# EAGLE design Front_panel_piezo (EAGLE 9.3.1)
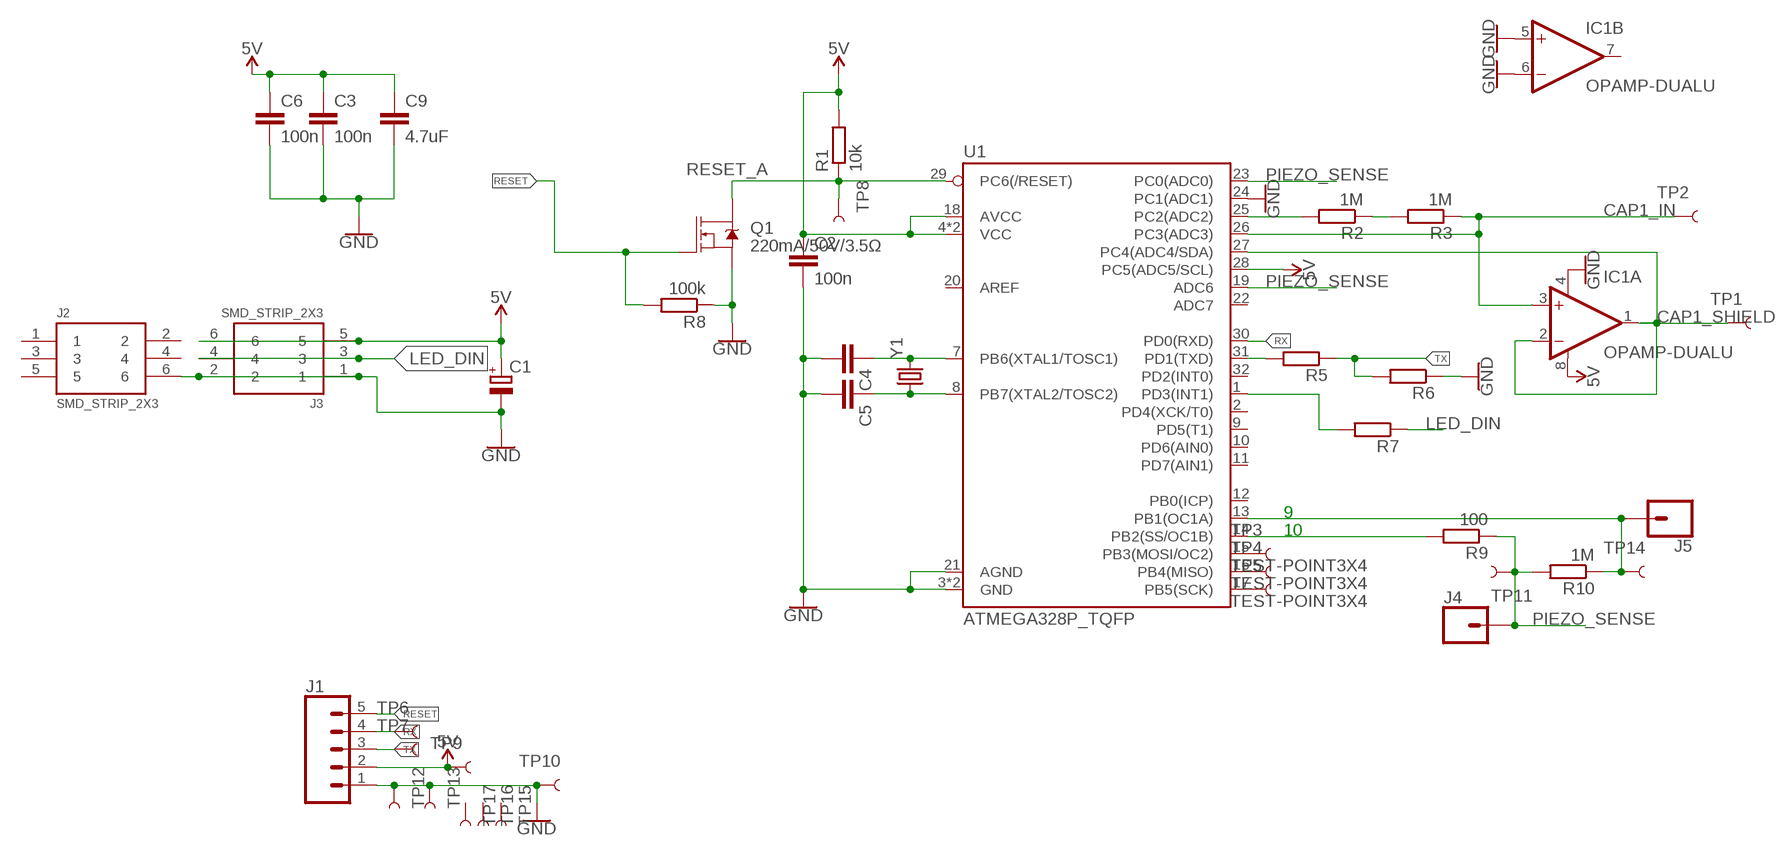
[diagram p0: schematic, sheet 1]

## Parts
C1  CPOL-EUCT6032  [CT6032]
C2  100n  C-EUC0805  [C0805]
C3  100n  C-EUC0805  [C0805]
C4  C-EUC0805  [C0805]
C5  C-EUC0805  [C0805]
C6  100n  C-EUC0805  [C0805]
C9  4.7uF  C-EUC0805  [C0805]
IC1  OPAMP-DUALU  [SO08]
J1  CONN_05SMD2  [1X05_1MM_RA]
J2  SMD_STRIP_2X3  [SMD_STRIP_2X3]
J3  SMD_STRIP_2X3  [SMD_STRIP_2X3]
J4  CONN_01SPRING-CONN  [SPRING-CONNECTOR]
J5  CONN_01SPRING-CONN  [SPRING-CONNECTOR]
Q1  220mA/50V/3.5Ω  MOSFET-NCH-BSS138  [SOT23-3]
R1  10k  R-EU_R0805  [R0805]
R2  1M  R-EU_R0805  [R0805]
R3  1M  R-EU_R0805  [R0805]
R5  R-EU_R0805  [R0805]
R6  R-EU_R0805  [R0805]
R7  R-EU_R0805  [R0805]
R8  100k  R-EU_R0805  [R0805]
R9  100  R-EU_R0805  [R0805]
R10  1M  R-EU_R0805  [R0805]
TP1  TEST-POINT3X4  [PAD.03X.04]
TP2  TEST-POINT3X4  [PAD.03X.04]
TP3  TEST-POINT3X4  [PAD.03X.04]
TP4  TEST-POINT3X4  [PAD.03X.04]
TP5  TEST-POINT3X4  [PAD.03X.04]
TP6  TEST-POINT3X4  [PAD.03X.04]
TP7  TEST-POINT3X4  [PAD.03X.04]
TP8  TEST-POINT3X4  [PAD.03X.04]
TP9  TEST-POINT3X4  [PAD.03X.04]
TP10  TEST-POINT3X4  [PAD.03X.04]
TP11  TEST-POINT3X4  [PAD.03X.04]
TP12  TEST-POINT3X4  [PAD.03X.04]
TP13  TEST-POINT3X4  [PAD.03X.04]
TP14  TEST-POINT3X4  [PAD.03X.04]
TP15  TEST-POINT3X4  [PAD.03X.04]
TP16  TEST-POINT3X4  [PAD.03X.04]
TP17  TEST-POINT3X4  [PAD.03X.04]
U1  ATMEGA328P_TQFP  [TQFP32-08]
Y1  CRYSTALSMD-3.2X2.5  [CRYSTAL-SMD-3.2X2.5MM]

## Nets
5V: C1.-(+) C2.1 C3.1 C6.1 C9.1 IC1.8(A:V+) J1.2 J3.5 J3.6 R1.2 TP9.P$1 U1.4(VCC) U1.6(VCC) U1.18(AVCC) U1.28(PC5(ADC5/SCL))
CAP1_IN: IC1.3(A:+IN) R3.1 TP2.P$1 U1.26(PC3(ADC3))
CAP1_SHIELD: IC1.1(A:OUT) IC1.2(A:-IN) TP1.P$1 U1.27(PC4(ADC4/SDA))
GND: C1.+(-) C2.2 C3.2 C4.2 C5.2 C6.2 C9.2 IC1.4(A:V-) IC1.5(B:+IN) IC1.6(B:-IN) J1.1 J2.6 J3.1 J3.2 Q1.2(S) R6.1 R8.1 TP10.P$1 TP12.P$1 TP13.P$1 U1.3(GND) U1.5(GND) U1.21(AGND) U1.24(PC1(ADC1))
LED_DIN: J3.3 J3.4 R7.1
N$1: R2.2 U1.25(PC2(ADC2))
N$2: R7.2 U1.1(PD3(INT1))
N$3: R2.1 R3.2
N$4: C4.1 U1.7(PB6(XTAL1/TOSC1)) Y1.3
N$5: C5.1 U1.8(PB7(XTAL2/TOSC2)) Y1.1
N$9: R5.2 U1.31(PD1(TXD))
N$10: J5.P$2 R10.1 TP14.P$1 U1.13(PB1(OC1A))
N$11: R9.2 U1.14(PB2(SS/OC1B))
N$14: TP3.P$1 U1.15(PB3(MOSI/OC2))
N$15: TP4.P$1 U1.16(PB4(MISO))
N$16: TP5.P$1 U1.17(PB5(SCK))
PIEZO_SENSE: J4.P$2 R9.1 R10.2 TP11.P$1 U1.19(ADC6) U1.23(PC0(ADC0))
RESET: J1.5 Q1.1(G) R8.2
RESET_A: Q1.3(D) R1.1 TP8.P$1 U1.29(PC6(/RESET))
RX: J1.4 TP6.P$1 U1.30(PD0(RXD))
TX: J1.3 R5.1 R6.2 TP7.P$1
Unconnected: IC1.7(B:OUT) J2.1 J2.2 J2.3 J2.4 J2.5 TP15.P$1 TP16.P$1 TP17.P$1 U1.2(PD4(XCK/T0)) U1.9(PD5(T1)) U1.10(PD6(AIN0)) U1.11(PD7(AIN1)) U1.12(PB0(ICP)) U1.20(AREF) U1.22(ADC7) U1.32(PD2(INT0))

## Notes on the sheet
- 9
- 10

## Library data of the parts
C1 = resistor:CPOL-EU: POLARIZED CAPACITOR, European symbol
C2-C6 C9 = resistor:C-EU: CAPACITOR, European symbol
IC1 = SparkFun:OPAMP-DUAL: Operational Amplifier
J1 = mastrogippo:CONN_05: Multi connection point. Often used as Generic Header-pin footprint for 0.1 inch spaced/style header connections On any of the 0.1 inch spaced packages, you can populate with these: Break Away Headers - Straight <https://www.sparkfun.com/products/116> (PRT-00116) Break Away Male Headers - Right Angle <https://www.sparkfun.com/products/553> (PRT-00553) Female Headers <https://www.sparkfun.com/products/115> (PRT-00115) Break Away Headers - Machine Pin <https://www.sparkfun.com/products/117> (PRT-00117) Break Away Female Headers - Swiss Machine Pin <https://www.sparkfun.com/products/743> (PRT-00743) For SCREWTERMINALS and SPRING TERMINALS visit here: Screw Terimnals on SparkFun.com <https://www.sparkfun.com/search/results?term=Screw+Terminals> (5mm/3.5mm/2.54mm spacing) This device is also useful as a general connection point to wire up your design to another part of your project. Our various solder wires solder well into these plated through hole pads. Hook-Up Wire - Assortment (Stranded, 22 AWG) <https://www.sparkfun.com/products/11375> (PRT-11375) Hook-Up Wire - Assortment (Solid Core, 22 AWG) <https://www.sparkfun.com/products/11367> (PRT-11367) View the entire wire category on our website here <https://www.sparkfun.com/categories/141> Special notes: Molex polarized connector foot print use with SKU : PRT-08231 with associated crimp pins and housings. 1MM SMD Version SKU: PRT-10208
J2 J3 = mastrogippo:SMD_STRIP_2X3: DOUBLE HORIZONTAL TERMINAL STRIP.
J4 J5 = SparkFun-Connectors:CONN_01: Single connection point. Often used as Generic Header-pin footprint for 0.1 inch spaced/style header connections On any of the 0.1 inch spaced packages, you can populate with these: Break Away Headers - Straight <https://www.sparkfun.com/products/116> (PRT-00116) Break Away Male Headers - Right Angle <https://www.sparkfun.com/products/553> (PRT-00553) Female Headers <https://www.sparkfun.com/products/115> (PRT-00115) Break Away Headers - Machine Pin <https://www.sparkfun.com/products/117> (PRT-00117) Break Away Female Headers - Swiss Machine Pin <https://www.sparkfun.com/products/743> (PRT-00743) This device is also useful as a general connection point to wire up your design to another part of your project. Our various solder wires solder well into these plated through hole pads. Hook-Up Wire - Assortment (Stranded, 22 AWG) <https://www.sparkfun.com/products/11375> (PRT-11375) Hook-Up Wire - Assortment (Solid Core, 22 AWG) <https://www.sparkfun.com/products/11367> (PRT-11367) View the entire wire category on our website here <https://www.sparkfun.com/categories/141> Special notes: SMTSO-256-ET is a "flush mount" nut for a 4-40 screw. We mostly use this on specialty testbeds; it is a nice way to connect hardware to your PCB at an adjustable hieght. Also note, the SNAP packages are for using a snappable style connector. We sell a baggie of snaps and they are also used on two LilyPad designs: Snap Assortment - 30 pack (male and female) <https://www.sparkfun.com/products/11347> (DEV-11347) LilyPad Arduino SimpleSnap <https://www.sparkfun.com/products/10941> (DEV-10941) LilyPad SimpleSnap Protoboard <https://www.sparkfun.com/products/10940> (DEV-10940); SF_ID: PRT-11822
Q1 = SparkFun-DiscreteSemi:MOSFET-NCH: N-channel MOSFETs Voltage controlled devices that allow control of high current outputs. SparkFun Products: SparkFun OpenScale <https://www.sparkfun.com/products/13261> SparkFun Digital Sandbox <https://www.sparkfun.com/products/12651> SparkFun Monster Moto Shield <https://www.sparkfun.com/products/10182> SparkFun MOSFET Power Controller <https://www.sparkfun.com/products/11214>; PROD_ID: TRANS-00830
R1-R3 R5-R10 = resistor:R-EU_: RESISTOR, European symbol
TP1-TP17 = SparkFun-Connectors:TEST-POINT: SparkFun Test Points Bare copper test points for troubleshooting or In-Circuit-Testing. These are used by our Production team for verifying production board runs using pogo-pins on test beds. SparkFun Products: SparkFun LSM9DS1 Breakout <https://www.sparkfun.com/products/13284> SparkFun PSOC <https://www.sparkfun.com/products/13714> SparkFun Load Cell Amplifier <https://www.sparkfun.com/products/13879>
U1 = SparkFun-IC-Microcontroller:ATMEGA328P_TQFP: Popular 328P in QFP Storefront component: ATmega328 - TQFP <https://www.sparkfun.com/products/13448> (COM-13448) Datasheet <http://www.sparkfun.com/datasheets/Components/SMD/ATMega328.pdf> SparkFun Products SparkFun RedBoard - Programmed with Arduino <https://www.sparkfun.com/products/12757> (DEV-12757) Arduino Pro Mini 328 - 5V/16MHz <https://www.sparkfun.com/products/11113> (DEV-11113) Arduino Pro Mini 328 - 3.3V/8MHz <https://www.sparkfun.com/products/11114> (DEV-11114) SparkFun OpenLog <https://www.sparkfun.com/products/13712> (DEV-13712) SparkFun MicroView - OLED Arduino Module <https://www.sparkfun.com/products/12923> (DEV-12923) SparkFun Digital Sandbox <https://www.sparkfun.com/products/12651> (DEV-12651) SparkFun PicoBoard <https://www.sparkfun.com/products/11888> (WIG-11888) Arduino Fio <https://www.sparkfun.com/products/10116> (DEV-10116) LilyPad Arduino 328 Main Board <https://www.sparkfun.com/products/13342> (DEV-13342) SparkFun RedStick <https://www.sparkfun.com/products/13741> (DEV-13741) LilyPad MP3 <https://www.sparkfun.com/products/11013> (DEV-11013) LilyPad Arduino SimpleSnap <https://www.sparkfun.com/products/10941> (DEV-10941) SparkFun Stepoko <https://www.sparkfun.com/products/13899> (ROB-13899) SparkFun Geiger Counter <https://www.sparkfun.com/products/11345> (SEN-11345) SparkFun EL Sequencer <https://www.sparkfun.com/products/12781> (COM-12781) Arduino Pro 328 - 5V/16MHz <https://www.sparkfun.com/products/10915> (DEV-10915) CryptoCape <https://www.sparkfun.com/products/12773> (DEV-12773) SparkFun IR Thermometer Evaluation Board - MLX90614 <https://www.sparkfun.com/products/10740> (SEN-10740) SparkFun RedBot Mainboard <https://www.sparkfun.com/products/12097> (ROB-12097) Arduino Pro 328 - 3.3V/8MHz <https://www.sparkfun.com/products/10914> (DEV-10914) SparkFun Block for Intel® Edison - Arduino <https://www.sparkfun.com/products/13036> (DEV-13036) SparkFun Simon Says - Surface Mount Soldering Kit <https://www.sparkfun.com/products/10935> (KIT-10935) SparkFun 7-Segment Serial Display - Red <https://www.sparkfun.com/products/11441> (COM-11441) SparkFun 7-Segment Serial Display - White <https://www.sparkfun.com/products/11629> (COM-11629) SparkFun 7-Segment Serial Display - Yellow <https://www.sparkfun.com/products/11443> (COM-11443) SparkFun 7-Segment Serial Display - Kelly Green <https://www.sparkfun.com/products/11440> (COM-11440) SparkFun 7-Segment Serial Display - Blue <https://www.sparkfun.com/products/11442> (COM-11442) SparkFun OpenSegment Serial Display - 20mm (Blue) <https://www.sparkfun.com/products/11647> (COM-11647) SparkFun OpenSegment Serial Display - 20mm (Green) <https://www.sparkfun.com/products/11646> (COM-11646) SparkFun OpenSegment Serial Display - 20mm (White) <https://www.sparkfun.com/products/11648> (COM-11648) SparkFun OpenSegment Serial Display - 20mm (Red) <https://www.sparkfun.com/products/11644> (COM-11644) SparkFun OpenSegment Serial Display - 20mm (Yellow) <https://www.sparkfun.com/products/11645> (COM-11645) SparkFun OpenSegment Shield <https://www.sparkfun.com/products/13190> (DEV-13190); PROD_ID: IC-09069
Y1 = SparkFun-Clocks:CRYSTAL: Crystals (Generic) These are passive quartz crystals, which can be used as a clock source for a microcontroller. Crystal's are two-terminal devices. They require external "load" capacitors to generate an oscillating signal.

## Board
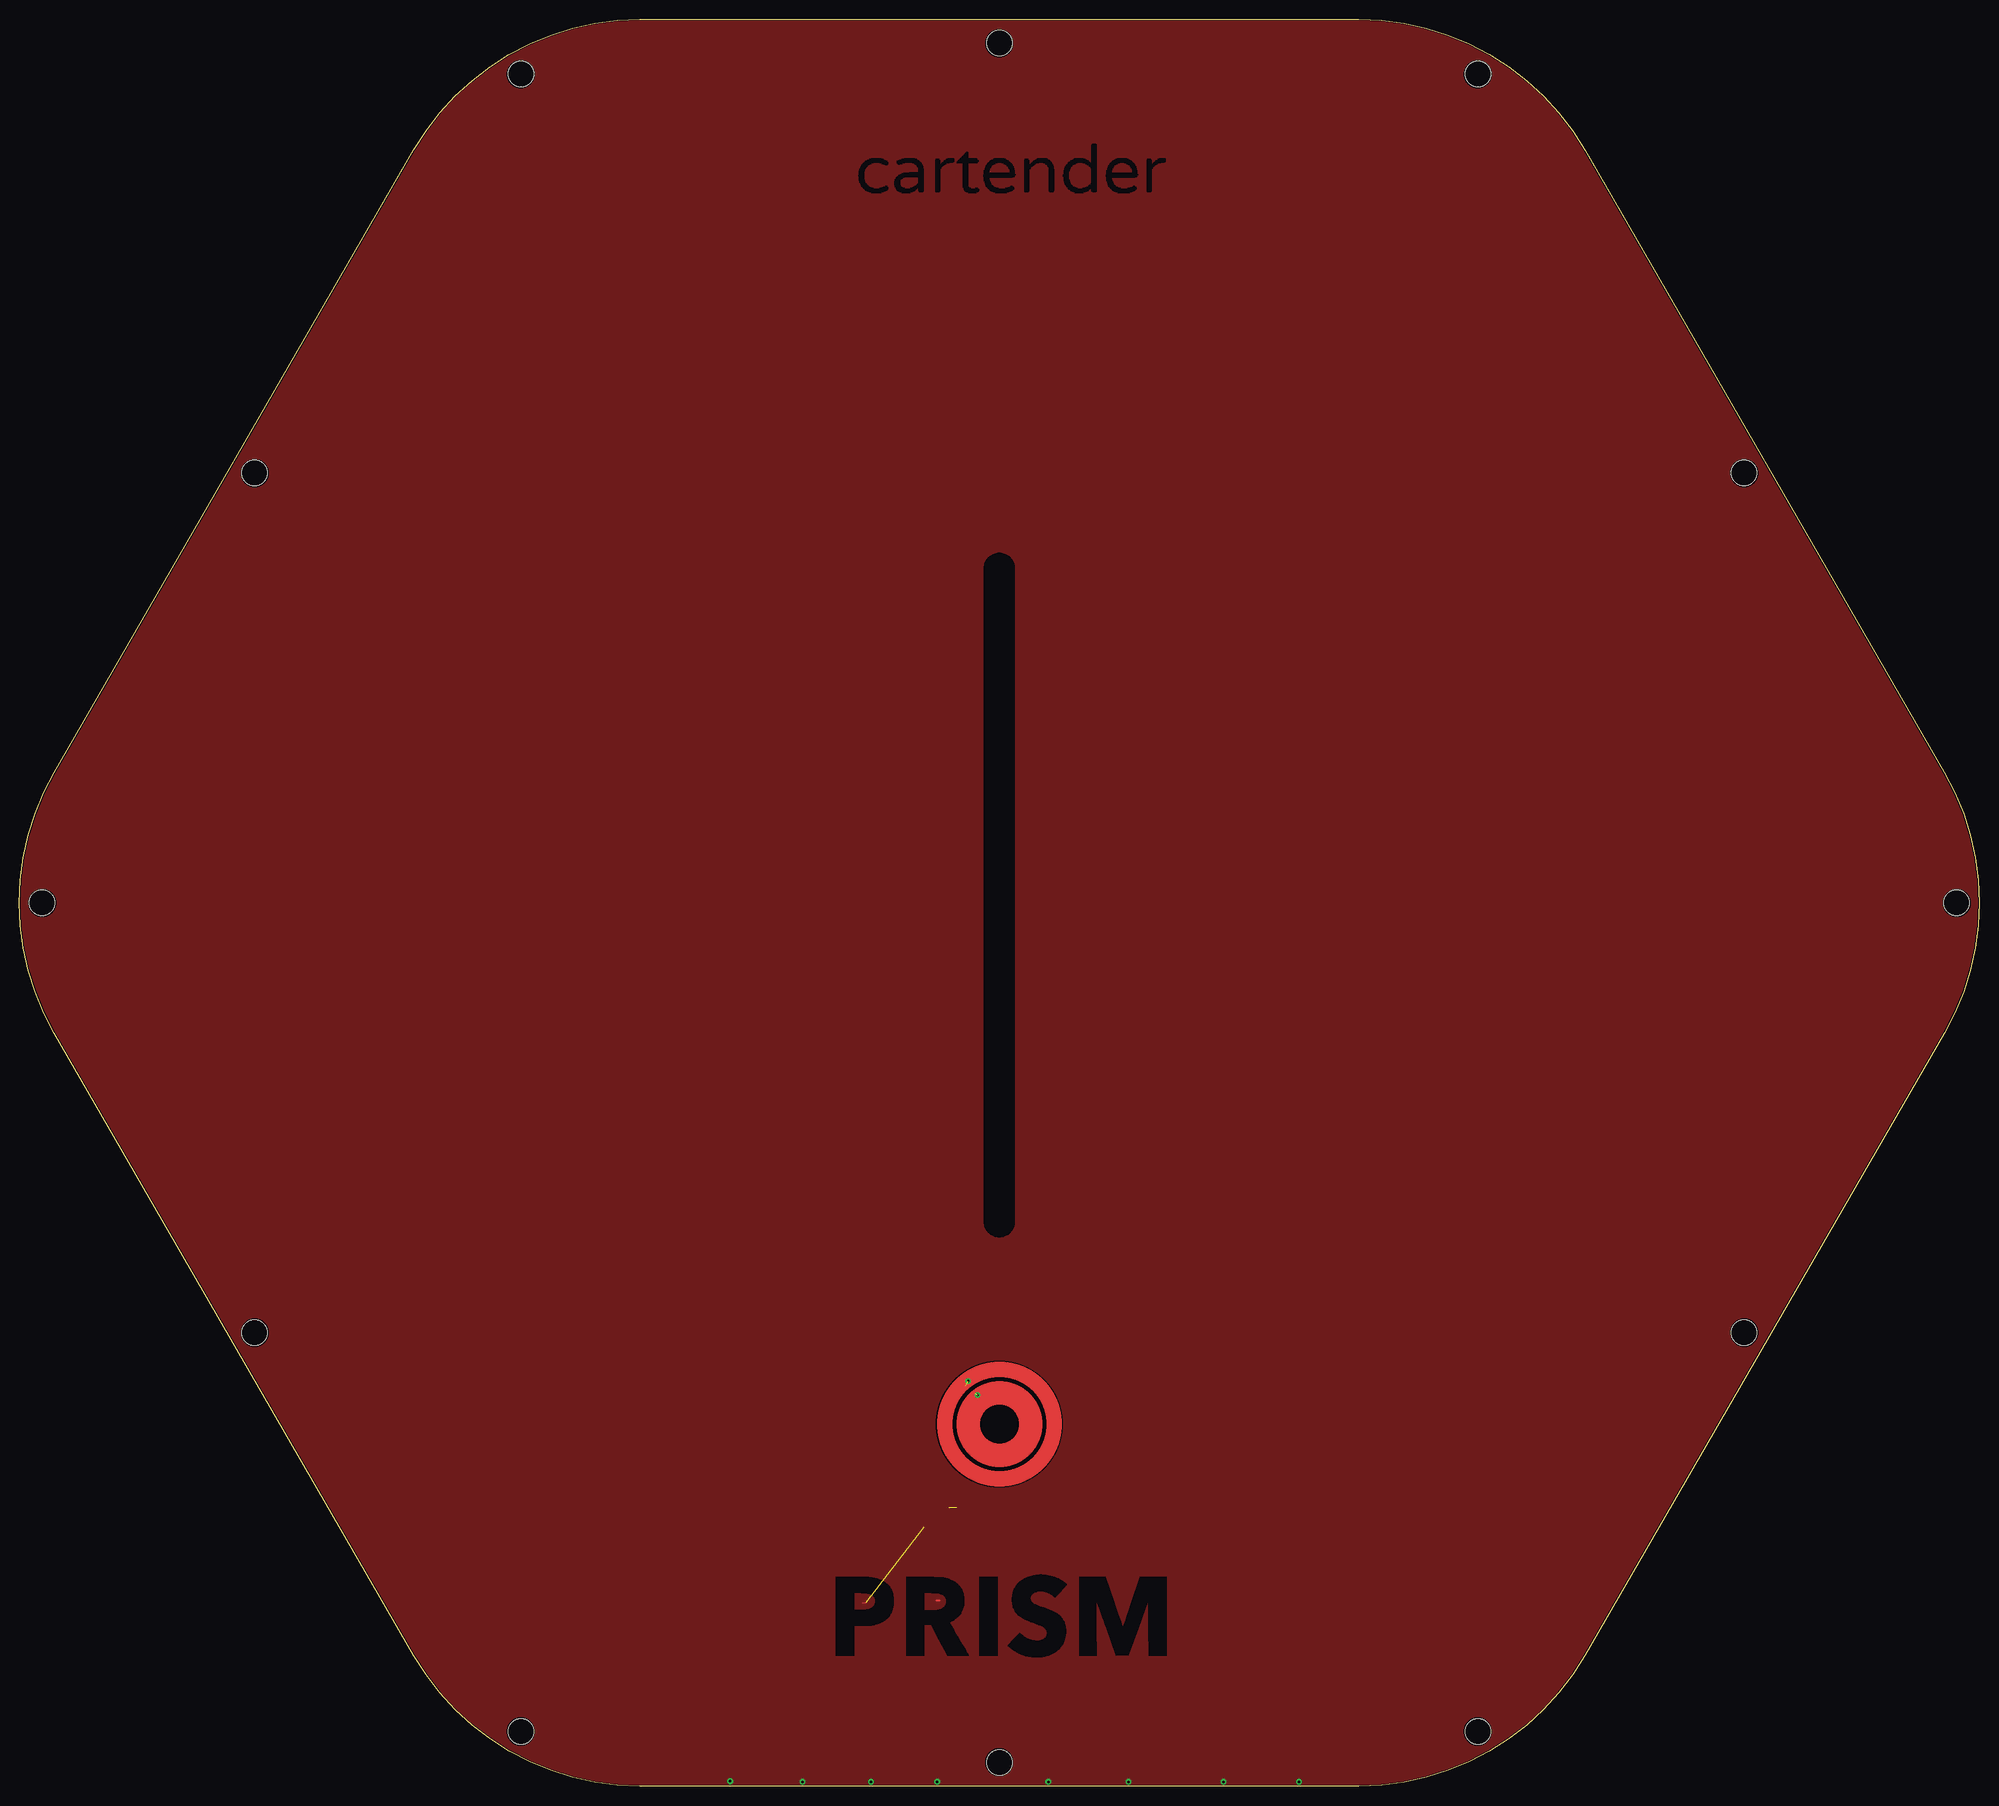
[diagram p1: board, top side]
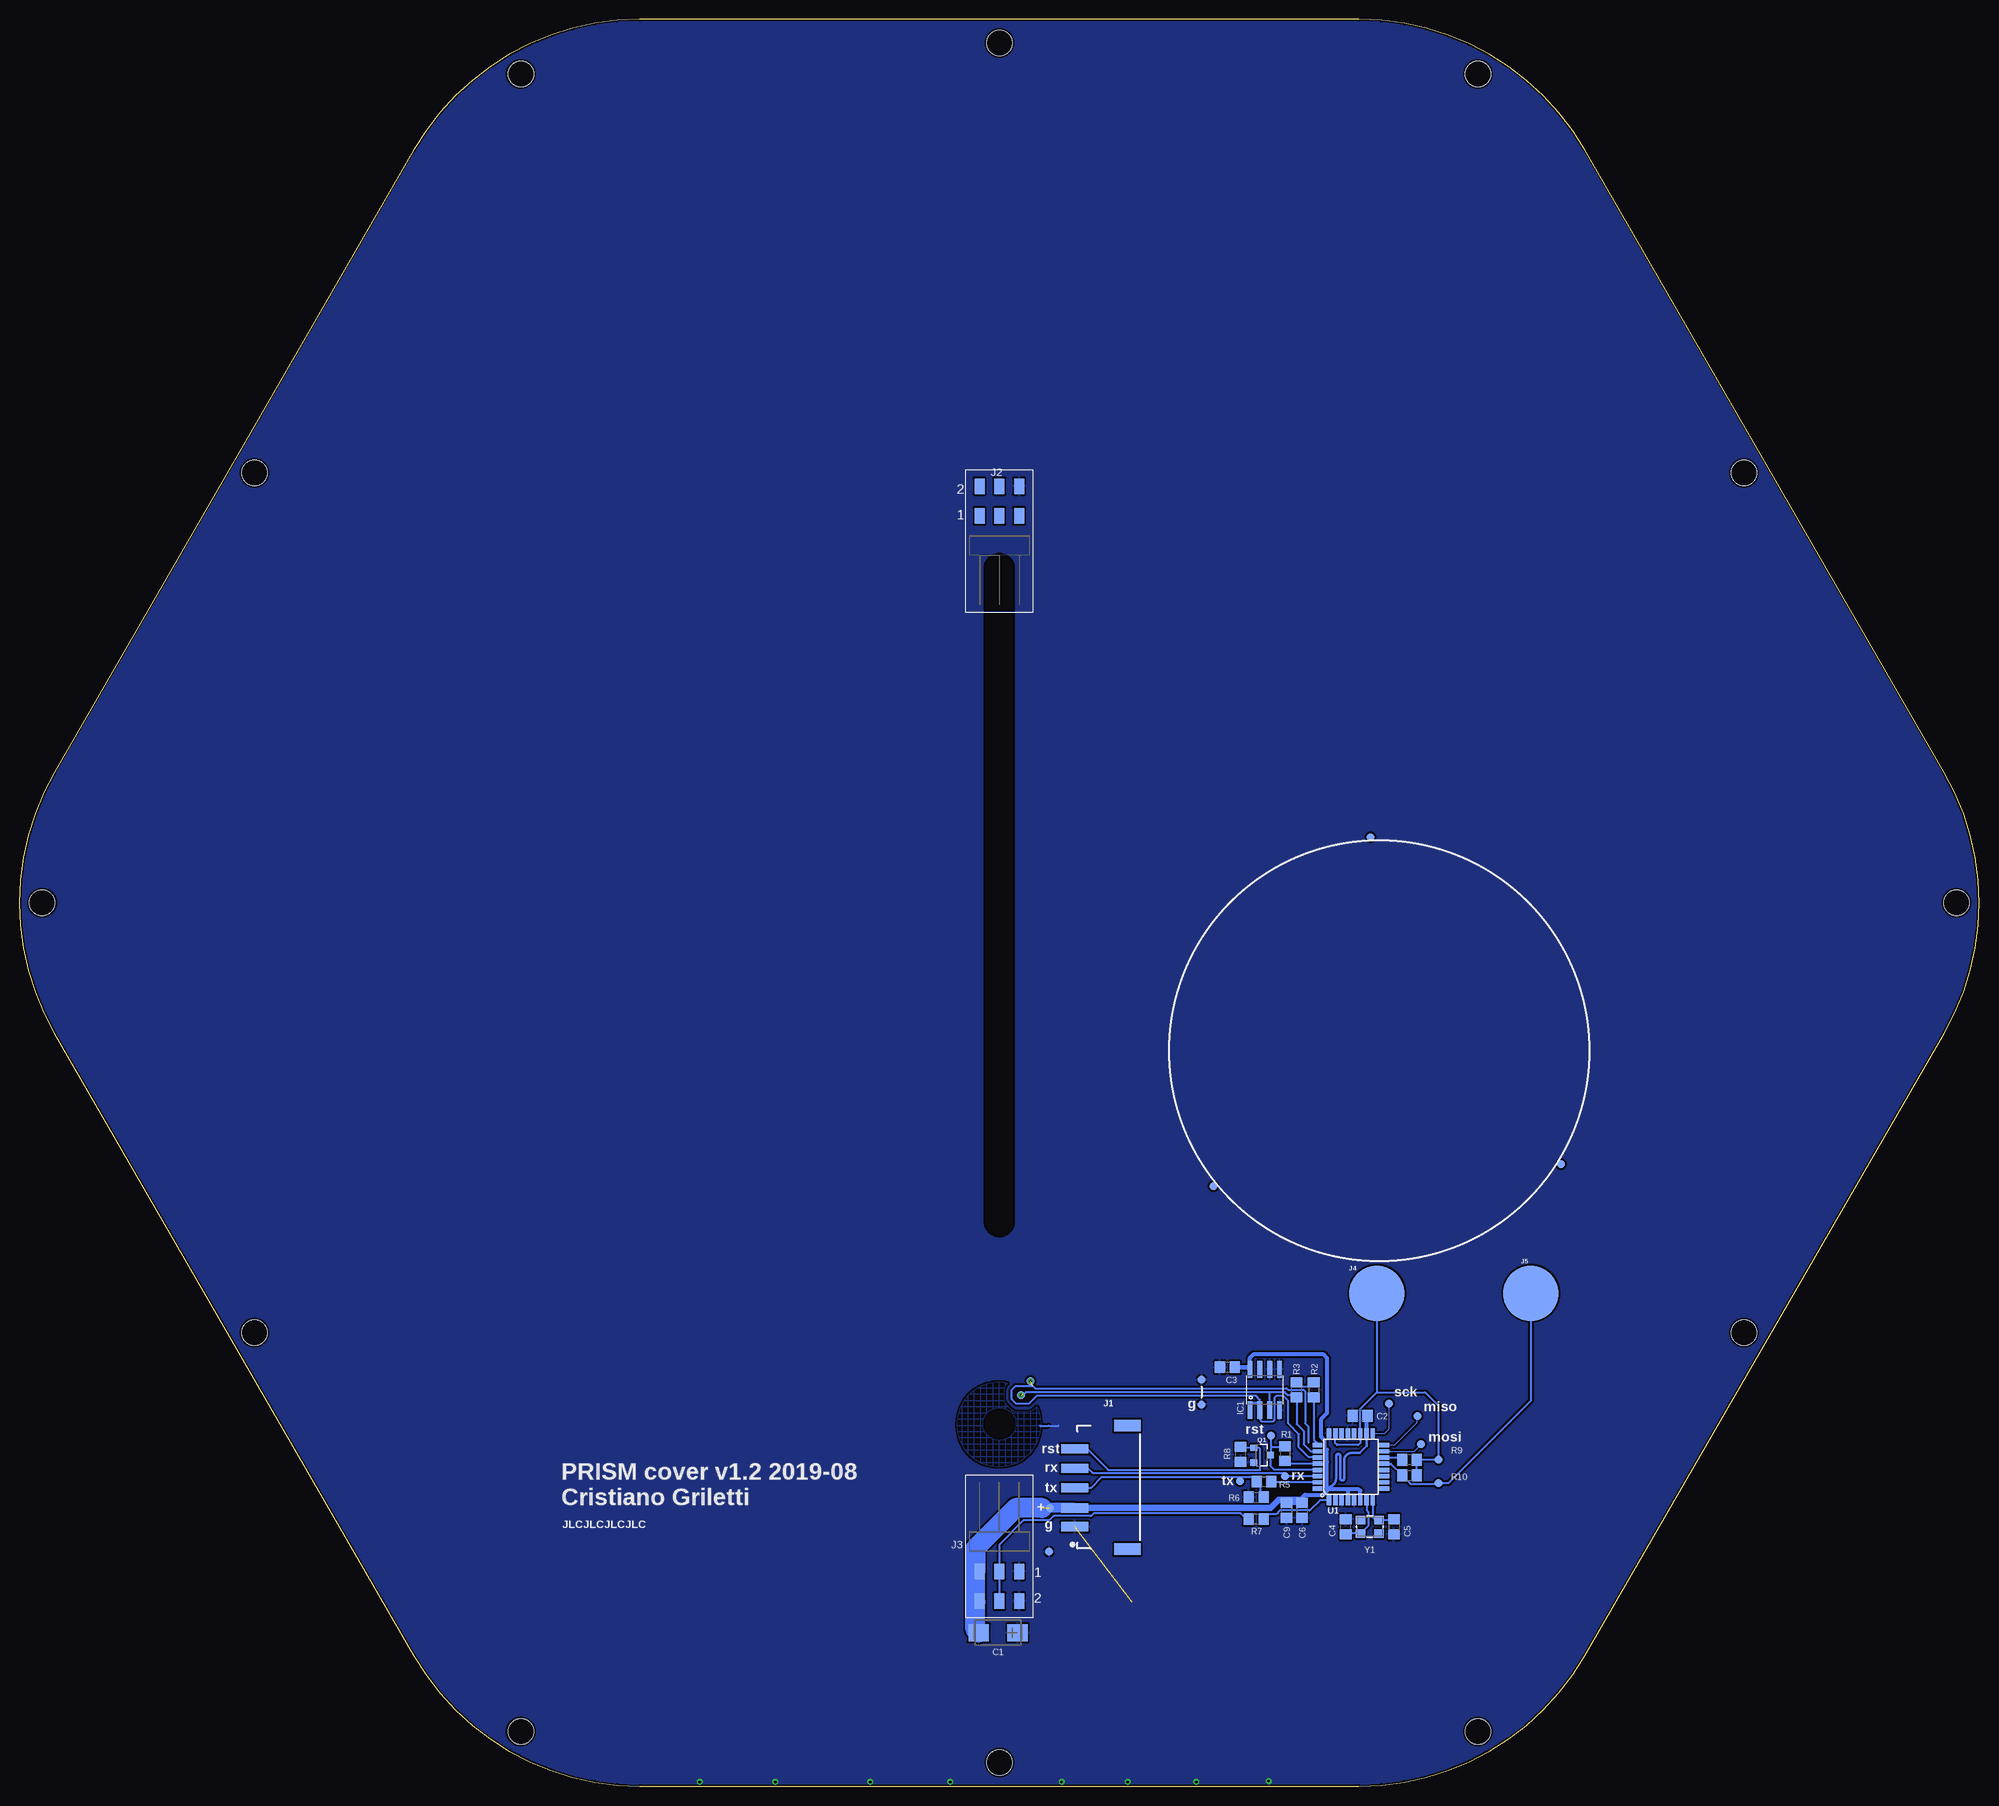
[diagram p2: board, bottom side, seen from below]

Size 251.85 x 227.1 mm. Coordinates in mm from the lower left corner, seen from the top.
Outline: 50.68,210.32 arc-60 79.74,227.1 172.11,227.1 arc-60 201.17,210.32 247.35,130.32 arc-60 247.35,96.77 201.17,16.77 arc-60 172.11,0 79.74,0 arc-60 50.68,16.77 4.5,96.77 arc-60 4.5,130.32 50.68,210.32
Copper layers (1*16): Top 0.035mm / dielectric 1.5mm / Bottom 0.035mm
Design rules "default *": minimum track width 6mil, minimum drill 0.3mm, track to track 6mil, track to pad 6mil, pad to pad 6mil, via to via 6mil, smd to smd 6mil, copper to edge 6mil, drill to drill 6mil, minimum pad ring 10mil, minimum via ring 8mil, stop-mask expansion 4mil, vias tented up to drill 100mil, thermal gap 10mil
Holes 3.3 mm at 64.42,7.03 125.92,3.05 30.22,58.3 2.92,113.55 248.92,113.55 187.42,7.03 221.62,58.3 30.22,168.8 64.42,220.07 125.92,224.05 187.42,220.07 221.62,168.8
tRestrict: area 109.5,204.8 to 110.7,204.9; area 113.4,204.8 to 114.5,204.9; area 121.9,204.8 to 122.9,204.9; area 125.4,204.8 to 126.9,204.9; area 135.6,204.8 to 136.7,204.9; area 141.1,204.8 to 142.7,204.9; area 109.2,204.9 to 111,204.9; area 113.1,204.9 to 114.7,204.9; area 115.6,204.9 to 116.1,204.9; area 117.8,204.9 to 118.2,204.9; area 121.7,204.9 to 123.2,204.9; area 125.1,204.9 to 127.2,204.9; 689 more areas; 199 lines

### Footprints (pad centres in the part's own frame; a part is rotated, then mirrored left to right if it is on the bottom)
CT6032 = smd 2.6 x 2.2: + -2.5,0; - 2.5,0
C0805 = smd 1.3 x 1.5: 1 -0.95,0; 2 0.95,0
SO08 = smd 0.61 x 2.21: 1 -1.905,-2.616; 2 -0.635,-2.616; 3 0.635,-2.616; 4 1.905,-2.616; 5 1.905,2.616; 6 0.635,2.616; 7 -0.635,2.616; 8 -1.905,2.616
1X05_1MM_RA = smd 1.2 x 3.5: 1 -5,0; 2 -2.6,0; 3 0,0; 4 2.5,0; 5 5,0 | smd 1.5 x 3.4: NC1 8,-6.775; NC2 -7.9,-6.775
SMD_STRIP_2X3 = smd 1.27 x 2: 1 2.54,-2.54; 2 2.54,-6.35; 3 0,-2.54; 4 0,-6.35; 5 -2.54,-2.54; 6 -2.54,-6.35
SPRING-CONNECTOR = smd 7.112 x 7.112: P$2 0,0
SOT23-3 = smd 0.8 x 0.9: 1 -0.95,-1; 2 0.95,-1; 3 0,1.1
R0805 = smd 1.3 x 1.5: 1 -0.95,0; 2 0.95,0
PAD.03X.04 = smd 1.016 x 1.016: P$1 0,0
TQFP32-08 = smd 1.27 x 0.559: 1 -4.293,2.8; 2 -4.293,2; 3 -4.293,1.2; 4 -4.293,0.4; 5 -4.293,-0.4; 6 -4.293,-1.2; 7 -4.293,-2; 8 -4.293,-2.8; 17 4.293,-2.8; 18 4.293,-2; 19 4.293,-1.2; 20 4.293,-0.4; 21 4.293,0.4; 22 4.293,1.2; 23 4.293,2; 24 4.293,2.8 | smd 0.559 x 1.27: 9 -2.8,-4.293; 10 -2,-4.293; 11 -1.2,-4.293; 12 -0.4,-4.293; 13 0.4,-4.293; 14 1.2,-4.293; 15 2,-4.293; 16 2.8,-4.293; 25 2.8,4.293; 26 2,4.293; 27 1.2,4.293; 28 0.4,4.293; 29 -0.4,4.293; 30 -1.2,4.293; 31 -2,4.293; 32 -2.8,4.293
CRYSTAL-SMD-3.2X2.5MM = smd 1.2 x 1.1: 1 -1.175,-0.875; 2 1.175,-0.875; 3 1.175,0.875; 4 -1.175,0.875

### Placement (x,y rotation side)
C1  126.08,19.72 180 bottom
C2  79.56,47.59 180 bottom
C3  96.62,53.85 180 bottom
C4  81.42,33.35 90 bottom
C5  75.22,33.35 270 bottom
C6  87.02,35.45 270 bottom
C9  89.02,35.45 270 bottom
IC1  91.82,50.95 0 bottom
J1  116.24,38.36 90 bottom
J2  125.92,160.75 180 bottom
J3  125.92,30.15 0 bottom
J4  77.42,63.35 0 bottom
J5  57.62,63.35 0 bottom
Q1  92.22,42.55 270 bottom
R1  89.22,42.75 270 bottom
R2  85.52,50.95 270 bottom
R3  87.72,50.95 90 bottom
R5  91.92,39.15 0 bottom
R6  92.92,37.15 0 bottom
R7  92.92,34.35 0 bottom
R8  94.92,42.65 90 bottom
R9  73.22,41.95 180 bottom
R10  73.22,39.95 0 bottom
TP1  121.92,52.05 0 bottom
TP2  123.12,50.25 0 bottom
TP3  71.72,43.95 0 bottom
TP4  72.22,47.55 0 bottom
TP5  75.82,49.15 0 bottom
TP6  89.22,39.85 0 bottom
TP7  95.02,39.25 0 bottom
TP8  91.02,45.05 0 bottom
TP9  119.42,35.75 0 bottom
TP10  119.52,30.15 0 bottom
TP11  69.52,41.95 0 bottom
TP12  99.92,52.25 0 bottom
TP13  99.92,49.05 0 bottom
TP14  69.52,38.95 0 bottom
TP15  78.22,121.95 0 bottom
TP16  53.72,79.95 0 bottom
TP17  98.42,77.15 0 bottom
U1  80.74,41.05 90 bottom
Y1  78.32,33.35 180 bottom

### Tracks (layer width: path | path; a pad name or v marks a point on that pad's centre or on a via)
5V  (1 unrouted)
  Bottom 0.254: 88.77,41.35 R1.2 88.87,41.45 U1.28 84.02,41.45 83.82,41.65
  Bottom 0.305: 84.22,44.55 84.02,44.35 84.02,43.45 83.82,43.25 | U1.18 78.74,43.73 79.62,42.85 80.62,42.85 arc-90 81.62,41.85 81.62,39.55 arc90 81.87,39.3 arc90 82.12,39.55 82.12,42.45 arc-180 82.62,42.45 82.62,39.75 arc81 83.82,38.35
  Bottom 0.508: 81.22,38.15 83.82,38.15 | U1.4 81.14,38.07 81.22,38.15 | U1.6 79.54,37.97 79.72,38.15 81.22,38.15 | U1.18 78.74,47.57 C2.1 | 83.82,38.15 83.82,38.35 83.82,41.65 83.82,43.25 | 83.82,38.15 83.82,37.95 83.98,37.8 83.99,37.8 84.33,37.46 86.66,37.46 87.02,37.1 C6.1 C9.1 | IC1.8 93.73,55.04 93.22,55.55 84.32,55.55 83.82,55.05 83.82,47.95 84.62,47.15 84.62,44.95 84.22,44.55
  Bottom 0.61: IC1.8 94.01,53.85 C3.1
  Bottom 0.813: C6.1 87.42,36.8 90.02,36.8 91.06,35.76 J1.2
  Bottom 1.27: J3.5 128.98,27.61 129.02,27.65 | J3.6 128.89,23.8 129.02,23.67 | J1.2 120.42,35.76
  Bottom 2.54: 120.42,35.76 123.81,35.76 129.02,30.55 129.02,27.65 129.02,23.67 129.02,20.16 C1.-
CAP1_IN  (via drill 0.3)  (1 unrouted)
  Bottom 0.254: U1.26 85.92,43.05 86.82,43.95 86.82,45.65 87.72,46.55 R3.1 88.02,50.3 88.87,50.3 89.22,50.65 91.22,50.65 | 91.22,50.65 122.52,50.65 122.72,50.45 122.82,50.45 122.92,50.55 | IC1.3 91.19,50.61 91.22,50.65
  other vias: 123.12,50.25
CAP1_SHIELD  (via drill 0.3)  (1 unrouted)
  Bottom 0.254: U1.27 85.14,42.35 86.22,42.35 87.42,43.55 87.42,45.25 88.82,46.65 88.82,49.55 89.42,50.15 90.32,50.15 90.57,49.9 90.57,47.1 90.82,46.85 92.12,46.85 92.42,47.15 92.42,48.3 IC1.2 | 86.22,44.15 86.22,46.25 86.62,46.65 86.62,50.75 86.82,50.95 88.82,50.95 89.02,51.15 121.32,51.15 121.62,51.45 123.82,51.45 124.32,50.95 124.32,49.75 123.72,49.15 122.12,49.15 121.12,50.15 92.92,50.15 92.46,49.68 IC1.2 | IC1.2 92.46,49.33 93.73,49.33 IC1.1
  other vias: 121.92,52.05
GND  (via drill 0.35)  (1 unrouted)
  Top 0: 108.32,23.55 108.72,23.55 108.82,23.65
  Bottom 0.254: 119.52,46.35 118.32,46.35
  other vias: 100.62,0.55 109.42,0.55 117.92,0.55 132.22,0.55 142.52,0.55 154.72,0.55 164.42,0.55 91.32,0.65
  pour Top (isolate 1): 101.22,215.45 149.42,215.45 157.02,207.85 157.02,194.95 152.32,190.25 113.02,190.25 98.72,204.55 98.72,204.65
  pour Bottom (isolate 0.254, rank 6): -13.68,-2.15 254.82,-2.15 254.82,230.55 -14.88,230.55 -14.88,-3.35
  pour Top (rank 6): 99.42,-2.15 254.82,-2.15 254.82,230.55 -14.88,230.55 -14.88,-2.25
  pour Top (no thermals): 102.02,214.15 102.02,195.95 99.12,193.05 156.02,193.05 162.32,199.35 162.32,213.15 158.72,216.75
GNDT
  Bottom 0.254: 120.72,46.35 119.62,46.35
  pour Bottom (isolate 0.8, hatched): 125.95,51.9 arc-90 131.38,46.47 arc-90 125.99,41.08 arc-90 120.56,46.51 arc-90
LED_DIN
  Bottom 0.254: R7.1 94.22,34.35 94.92,35.05 113.82,35.05 114.12,34.75 118.92,34.75 119.52,34.15 122.82,34.15 125.92,31.05 J3.3 J3.4
N$1
  Bottom 0.254: U1.25 85.04,44.05 85.52,44.54 R2.2
N$2
  Bottom 0.254: U1.1 84.72,36.76 86.05,35.43 89.89,35.43 90.37,34.95 91.37,34.95 R7.2
N$3
  Bottom 0.254: R3.2 87.22,51.4 86.02,51.4 R2.1
N$4
  Bottom 0.254: U1.7 78.74,35.47 78.52,35.25 78.52,33.45 Y1.3 81.35,32.47 C4.1
N$5
  Bottom 0.254: U1.8 77.94,34.57 77.6,34.22 Y1.1 75.3,34.22 C5.1
N$8
  Top 0.254: 118.22,23.85 117.82,23.85
  pour Top: 116.12,25.05 116.12,22.35 118.62,22.35 119.32,23.05 119.32,24.35 118.62,25.05
N$9
  Bottom 0.254: U1.31 90.87,39.05 R5.2
N$10
  Bottom 0.254: U1.13 75.62,41.45 74.17,40 R10.1 73.07,38.85 69.62,38.85 TP14.P$1 68.22,38.95 57.62,49.55 J5.P$2
N$11
  Bottom 0.254: U1.14 74.47,42.25 R9.2
N$14
  Bottom 0.152: U1.15 72.62,43.05 TP3.P$1
N$15
  Bottom 0.152: U1.16 75.12,43.85 72.22,46.75 TP4.P$1
N$16
  Bottom 0.152: U1.17 76.43,45.34 75.82,45.95 TP5.P$1
PIEZO_SENSE
  Bottom 0.254: U1.23 82.74,44.07 82.52,43.85 79.82,43.85 79.54,44.13 U1.19 79.54,48.53 77.42,50.65 | 77.42,50.65 71.22,50.65 69.52,48.95 TP11.P$1 R9.1 72.32,41.9 72.32,39.95 R10.2 | J4.P$2 77.42,50.65
RESET
  Bottom 0.254: J1.5 114.64,43.36 111.94,40.66 92.42,40.66 92.42,43.35 92.62,43.55 92.67,43.5 Q1.1 94.82,43.5 R8.2
RESET_A
  Bottom 0.254: U1.29 85.14,40.75 90.67,40.75 91.12,41.2 Q1.3 91.02,42.65 TP8.P$1 | 91.27,44.8 TP8.P$1 | TP8.P$1 91.02,43.6 89.32,43.6 R1.1
RX
  Bottom 0.254: J1.4 114.55,40.86 113.94,40.25 89.34,40.25 89.03,39.94 | 89.03,39.94 88.94,39.85 U1.30 | TP6.P$1 89.13,39.94 89.03,39.94
S$2
  cutout Bottom: 123.92,156.55 123.92,72.55 arc180 127.92,72.55 127.92,156.55 arc180
S$3
  cutout Bottom: 125.82,48.55 arc180 125.82,44.55 126.02,44.55 arc180 126.02,48.55 125.92,48.55
S$4
  cutout Top: 123.92,156.55 123.92,72.55 arc180 127.92,72.55 127.92,156.55 arc180
TX
  Bottom 0.254: 116.15,38.45 J1.3 114.14,38.36 112.75,39.75 95.02,39.75 | R6.2 92.42,37.6 92.42,38.7 R5.1 93.32,39.6 93.32,39.75 95.02,39.75 | TP7.P$1 95.02,39.75
(copper drawn outside any net)
  shapes: Top circle x2

### Text on the board
bNames: sck | miso | g | rst | mosi | rst | rx | rx | tx | tx | + | PRISM cover v1.2 2019-08 / Cristiano Griletti | g | JLCJLCJLCJLC